# EAGLE schematic ldr (EAGLE 6.4)
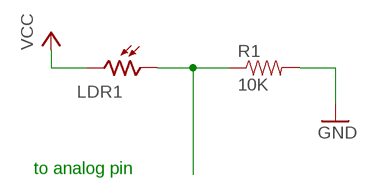
[diagram p0: schematic, sheet 1]

## Parts
LDR1  VT43N1  [VT400]
R1  10K  RESISTORPTH-1/4W  [AXIAL-0.4]

## Nets
GND: R1.P$2
N$1: LDR1.1 R1.P$1
VCC: LDR1.2

## Notes on the sheet
- to analog pin

## Library data of the parts
LDR1 = photo-elements:VT43N: Photoconductive Cell VT400 Series Source: http://optoelectronics.perkinelmer.com/content/Datasheets/DTS_vt400seriesdatasheet.pdf
R1 = SparkFun-Resistors:RESISTOR: Resistor Basic schematic elements and footprints for 0603, 1206, and PTH resistors.